# EasyEDA Pro project ProProject_OSC_Ver0.2_2023-11-09.epro, schematic Schematic3
Create Date: 2023-10-18; Page Name: P1; Project Name: OSC_Ver0.2; Schematic Name: Schematic3; Update Date: 2023-10-27; Company: 嘉立创EDA; Page Size: A5; Version: V1.0
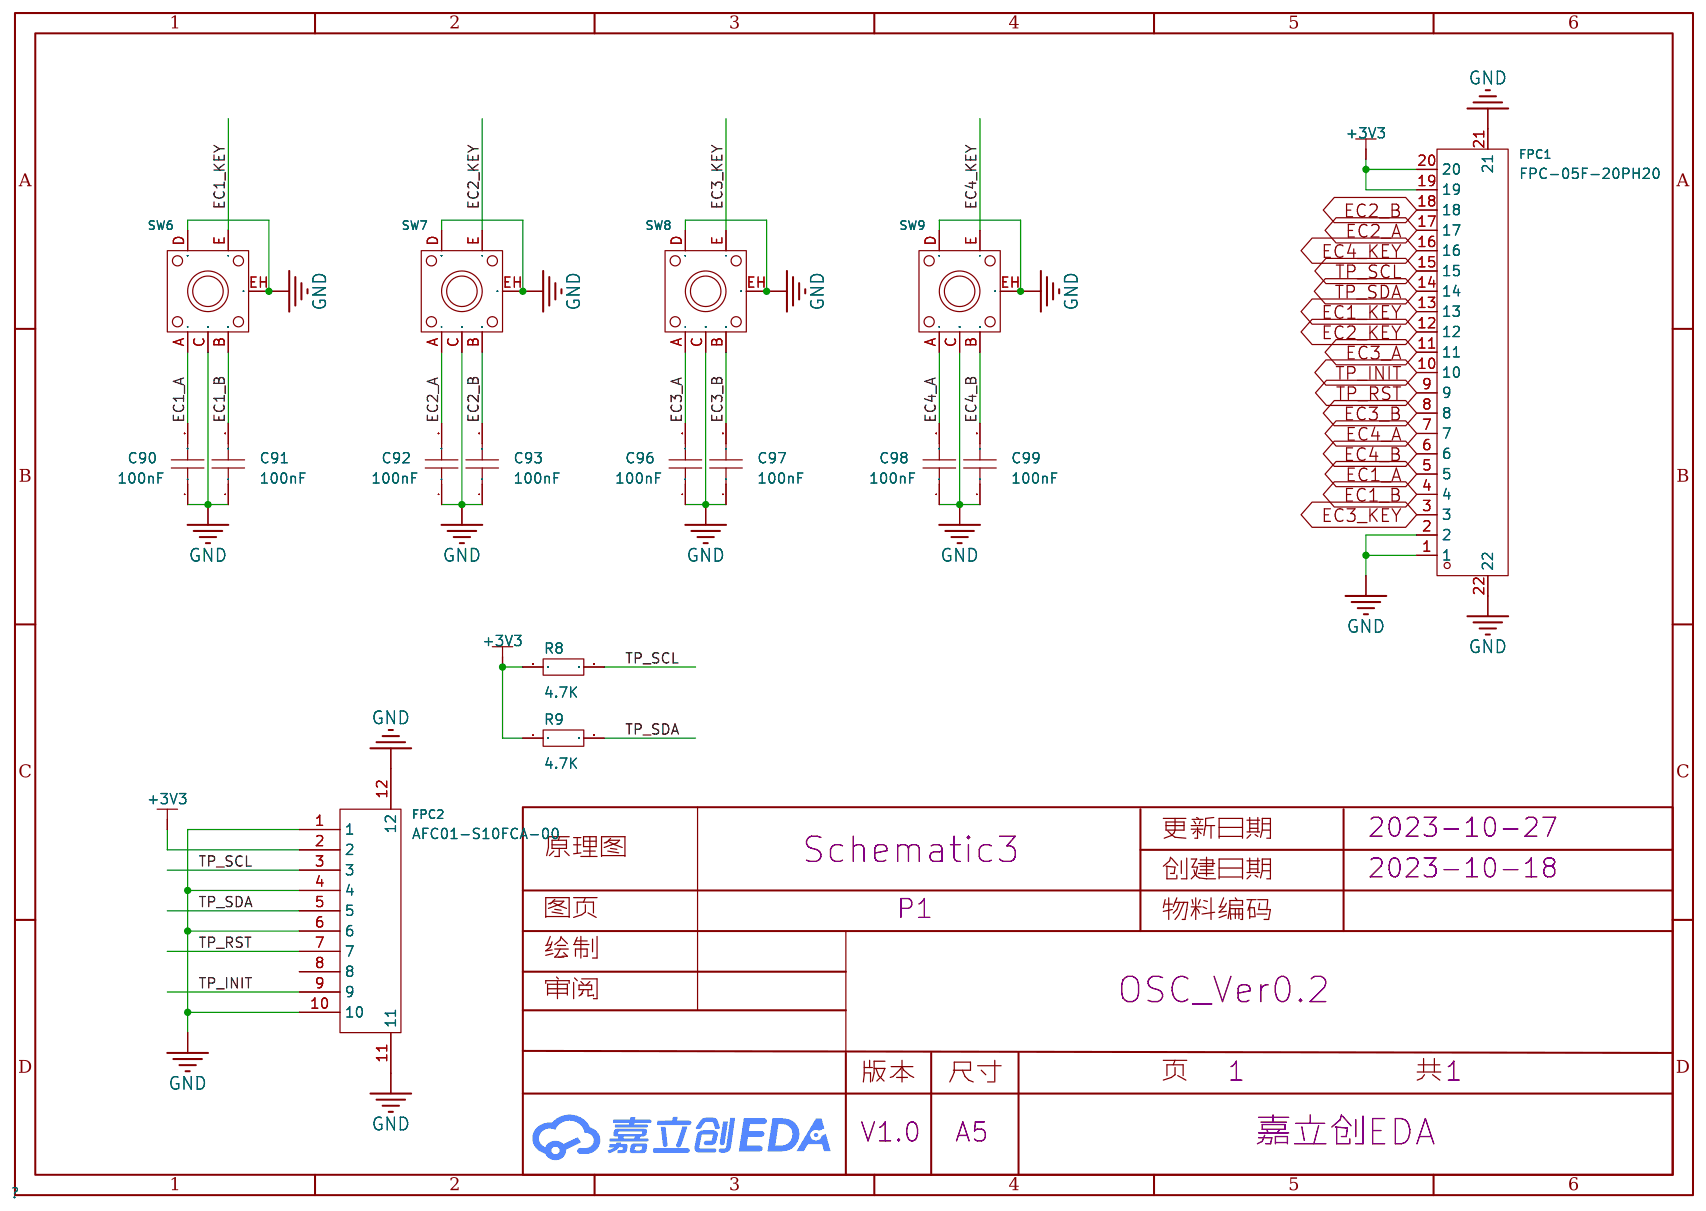
[diagram p0: schematic sheet]

## Parts
C90  100nF  [C0603]
C91  100nF  [C0603]
C92  100nF  [C0603]
C93  100nF  [C0603]
C96  100nF  [C0603]
C97  100nF  [C0603]
C98  100nF  [C0603]
C99  100nF  [C0603]
FPC1  FPC-05F-20PH20  [FPC-SMD_20P-P0.50_XUNPU_FPC-05F-20PH20]
FPC2  AFC01-S10FCA-00  [FPC-SMD_P0.5-10P_FGS-XJ-H2.0]
R8  10K  [R0603]
R9  10K  [R0603]
SW6  EC11B15242B1  [SW-TH_EC11B1524XX]
SW7  EC11B15242B1  [SW-TH_EC11B1524XX]
SW8  EC11B15242B1  [SW-TH_EC11B1524XX]
SW9  EC11B15242B1  [SW-TH_EC11B1524XX]

## Library data of the parts
C90-C93 C96-C99 = CAP_0603: Supplier Footprint: 0603
FPC1 = FPC-05F-20PH20: LCSC Part Name: 20P 0.5mm; Supplier Part: C2856803; Manufacturer: XUNPU(讯普); Supplier Footprint: SMD; JLCPCB Part Class: 扩展库; Supplier: LCSC
FPC2 = AFC01-S10FCA-00: 间距:0.5mm;触点数量:10P;锁定特性:翻盖式;安装类型:卧贴;触点类型:下接;; LCSC Part Name: 0.5mm P数:10P 翻盖式 下接; Supplier Part: C262659; Manufacturer: JS(钜硕电子); Supplier Footprint: SMD,P=0.5mm; JLCPCB Part Class: 扩展库; Datasheet: https://atta.szlcsc.com/upload/public/pdf/source/20190816/C413942_2A72D1AC756EAE17EEDF756A339D4500.pdf; Supplier: LCSC; Pitch: 0.5mm; Number of Contacts: 10P; Locking Feature: 翻盖式; Mounting Type: 卧贴; Contact Type: 下接; Height Above Board: 2mm; FFC, FCB Thickness: 0.3mm
R8 R9 = Res_0603: Supplier Footprint: 0603
SW6-SW9 = EC11B15242B1: LCSC Part Name: EC11B15242B1三件套 停产; Supplier Part: C470755; Manufacturer: ALPSALPINE(阿尔卑斯阿尔派); Supplier Footprint: 插件; JLCPCB Part Class: Extended Part; Datasheet: https://atta.szlcsc.com/upload/public/pdf/source/20191216/C470795_DE763ECE59BD49533DB26DB53E5D34B2.pdf; Supplier: LCSC

## Nets
+3V3: FPC1.19 FPC1.20 FPC2.2 R8.1 R9.1
GND: C90.1 C91.1 C92.1 C93.1 C96.1 C97.1 C98.1 C99.1 FPC1.1 FPC1.2 FPC1.21 FPC1.22 FPC2.1 FPC2.4 FPC2.6 FPC2.10 FPC2.11 FPC2.12 SW6.C SW6.D SW6.EH SW7.C SW7.D SW7.EH SW8.C SW8.D SW8.EH SW9.C SW9.D SW9.EH
EC1_A: C90.2 FPC1.5 SW6.A
EC1_B: C91.2 FPC1.4 SW6.B
EC1_KEY: FPC1.13 SW6.E
EC2_A: C92.2 FPC1.17 SW7.A
EC2_B: C93.2 FPC1.18 SW7.B
EC2_KEY: FPC1.12 SW7.E
EC3_A: C96.2 FPC1.11 SW8.A
EC3_B: C97.2 FPC1.8 SW8.B
EC3_KEY: FPC1.3 SW8.E
EC4_A: C98.2 FPC1.7 SW9.A
EC4_B: C99.2 FPC1.6 SW9.B
EC4_KEY: FPC1.16 SW9.E
TP_INIT: FPC1.10 FPC2.9
TP_RST: FPC1.9 FPC2.7
TP_SCL: FPC1.15 FPC2.3 R8.2
TP_SDA: FPC1.14 FPC2.5 R9.2

Not connected (* = marked no-connect by the designer): FPC2 8
